# EasyEDA schematic easyeda-schematic.json
TITLE: Sheet_1; REV: 1.0; Date: 2021-05-10; Sheet: 1/1; Drawn By: till.klocke; Company: Your Company
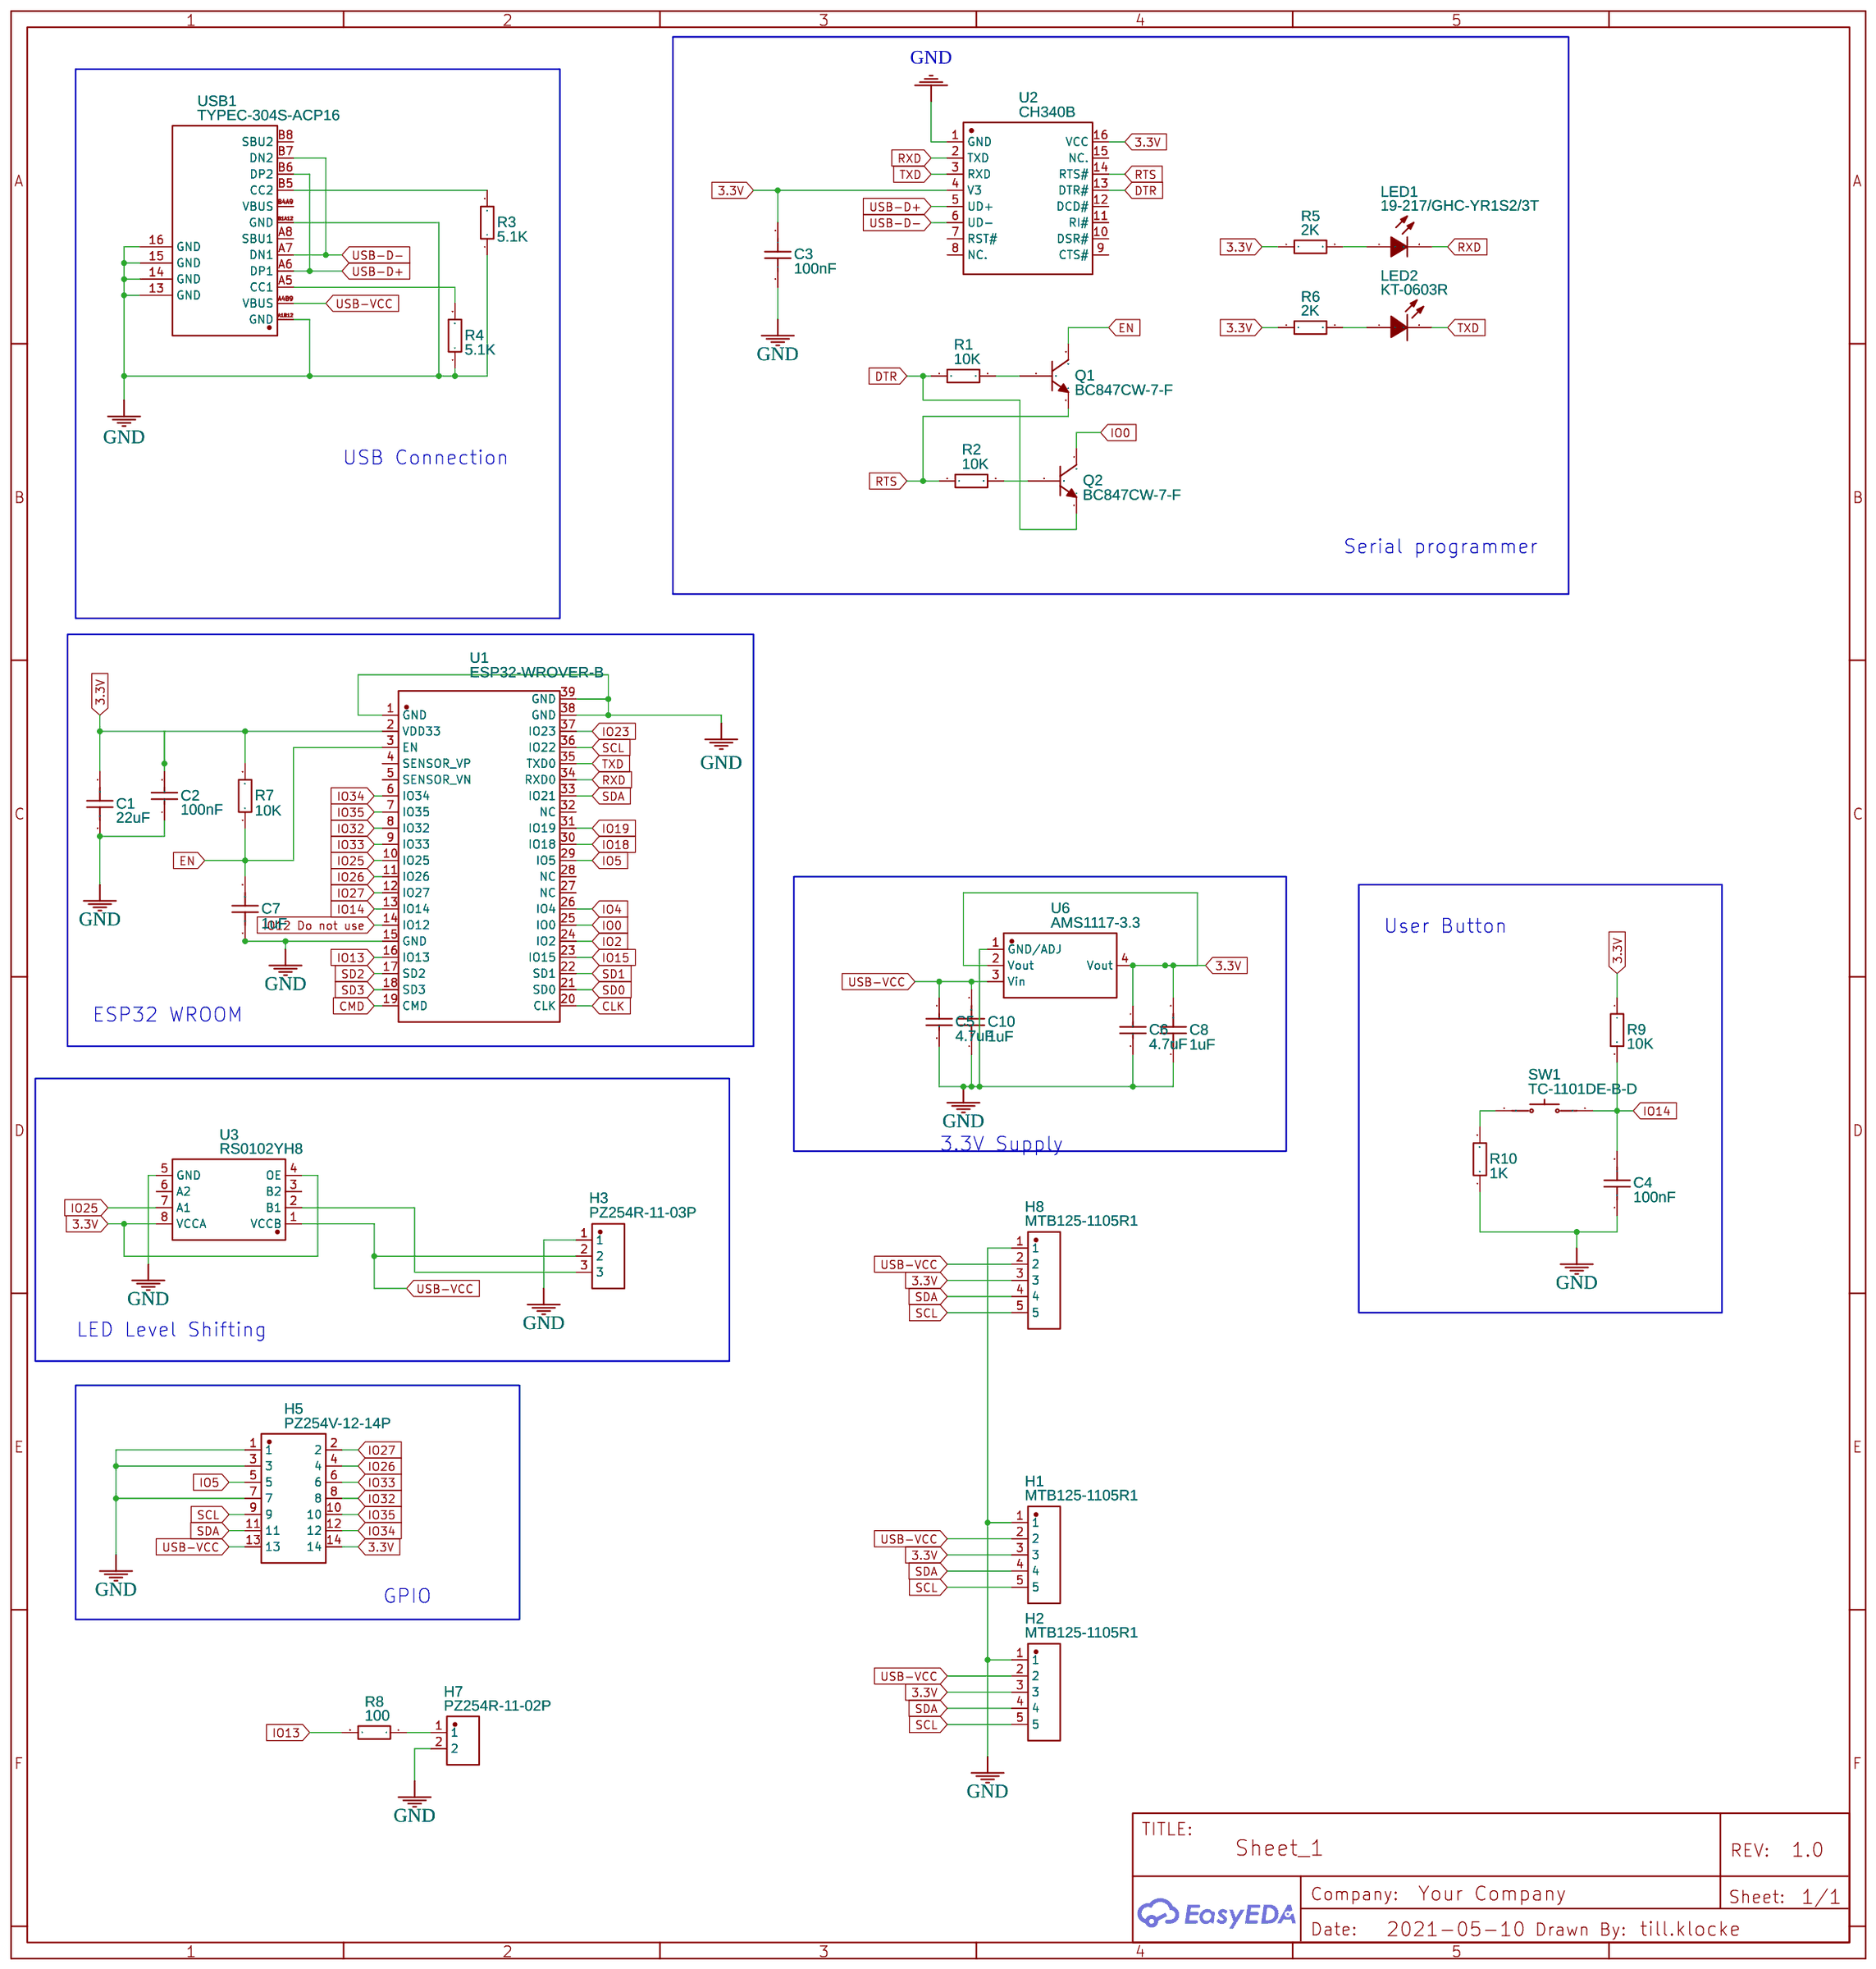
[diagram p0: schematic sheet]

## Parts
C1  22uF  [C0603]
C2  100nF  [C0402]
C3  100nF  [C0603]
C4  100nF  [C0603]
C5  4.7uF  [C0402]
C6  4.7uF  [C0402]
C7  1uF  [C0402]
C8  1uF  [C0402]
C10  1uF  [C0402]
H1  MTB125-1105R1  [HDR-TH_5P-P2.54-H-M-W10.0]
H2  MTB125-1105R1  [HDR-TH_5P-P2.54-H-M-W10.0]
H3  PZ254R-11-03P  [HDR-TH_3P-P2.54-H-M-W10.4]
H5  PZ254V-12-14P  [HDR-TH_14P-P2.54-V-M-R2-C7-S2.54]
H7  PZ254R-11-02P  [HDR-TH_2P-P2.54-H-M-W10.4]
H8  MTB125-1105R1  [HDR-TH_5P-P2.54-H-M-W10.0]
LED1  19-217/GHC-YR1S2/3T  [LED0603-R-RD]
LED2  KT-0603R  [LED0603-R-RD]
Q1  BC847CW-7-F  [SC-70-3_L2.1-W1.3-P1.30-LS2.1-BR]
Q2  BC847CW-7-F  [SC-70-3_L2.1-W1.3-P1.30-LS2.1-BR]
R1  10K  [R0402]
R2  10K  [R0402]
R3  5.1K  [R0805]
R4  5.1K  [R0805]
R5  2K  [R0402]
R6  2K  [R0402]
R7  10K  [R0402]
R8  100  [R0402]
R9  10K  [R0402]
R10  1K  [R0402]
SW1  TC-1101DE-B-D  [SW-TH_L6.1-W5.0-P5.00]
U1  ESP32-WROVER-B  [WIFIM-SMD_39P-L31.4-W18.0-P1.27]
U2  CH340B  [SOIC-16_L9.9-W3.9-P1.27-LS6.0-BL]
U3  RS0102YH8  [SOT-23-8_L3.0-W1.7-P0.65-LS2.8-BL]
U6  AMS1117-3.3  [SOT-223-3_L6.5-W3.4-P2.30-LS7.0-BR]
USB1  TYPEC-304S-ACP16  [USB-C-SMD_TYPEC-304S-ACP16]

## Library data of the parts
C1 = CL10A226MQ8NRNC: Supplier: LCSC; Manufacturer: SAMSUNG; Supplier Part: C59461; SMT Type: Basic; JLCPCB SMD: Yes; LCSC Assembly: Yes; Paste Type: base
C2 = CL05B104KO5NNNC: Supplier: LCSC; Manufacturer: SAMSUNG; Supplier Part: C1525; SMT Type: Basic; JLCPCB SMD: Yes; LCSC Assembly: Yes; Paste Type: base
C3 C4 = CC0603KRX7R9BB104: Supplier: LCSC; Manufacturer: YAGEO; Supplier Part: C14663; SMT Type: Basic; JLCPCB SMD: Yes; LCSC Assembly: Yes; Paste Type: base
C5 C6 = CL05A475MP5NRNC: Supplier: LCSC; Manufacturer: SAMSUNG; Supplier Part: C23733; SMT Type: Basic; JLCPCB SMD: Yes; LCSC Assembly: Yes; Paste Type: base
C7 C8 C10 = CL05A105KA5NQNC: Supplier: LCSC; Manufacturer: SAMSUNG; Supplier Part: C52923; SMT Type: Basic; JLCPCB SMD: Yes; LCSC Assembly: Yes; Paste Type: base
H1 H2 H8 = MTB125-1105R1: Supplier: LCSC; Supplier Part: C376123; Manufacturer: MINTRON; Contributor: LCSC; JLCPCB Part Class: Extended Part
H3 = PZ254R-11-03P: Supplier: LCSC; Supplier Part: C492411; Manufacturer: XFCN; Contributor: LCSC; JLCPCB Part Class: Extended Part
H5 = PZ254V-12-14P: Supplier: LCSC; Supplier Part: C492424; Manufacturer: XFCN; Contributor: LCSC; JLCPCB Part Class: Extended Part
H7 = PZ254R-11-02P: Supplier: LCSC; Supplier Part: C492410; Manufacturer: XFCN; Contributor: LCSC; JLCPCB Part Class: Extended Part
LED1 = 19-217/GHC-YR1S2/3T: Supplier: LCSC; Manufacturer: EVERLIGHT; image: //image.lceda.cn/szlcsc/C72043.jpg; Supplier Part: C72043; SMT Type: Basic; JLCPCB SMD: Yes; LCSC Assembly: Yes; Paste Type: base
LED2 = KT-0603R: Supplier: LCSC; Manufacturer: KENTO; image: //image.lceda.cn/szlcsc/C2286.jpg; Supplier Part: C2286; SMT Type: Basic; JLCPCB SMD: Yes; LCSC Assembly: Yes; Paste Type: base
Q1 Q2 = BC847CW-7-F: Supplier: LCSC; Manufacturer: DIODES; Contributor: LCSC; Supplier Part: C151600; SMT Type: Extend; JLCPCB SMD: Yes; LCSC Assembly: Yes; Paste Type: expand
R1 R2 R7 R9 = 0402WGF1002TCE: Supplier: LCSC; Manufacturer: UniOhm; Supplier Part: C25744; SMT Type: Basic; JLCPCB SMD: Yes; LCSC Assembly: Yes; Paste Type: base
R3 R4 = 0805W8F5101T5E: Supplier: LCSC; Manufacturer: UniOhm; Supplier Part: C27834; SMT Type: Basic; JLCPCB SMD: Yes; LCSC Assembly: Yes; Paste Type: base
R5 R6 = 0402WGJ0202TCE: Supplier: LCSC; Manufacturer: UniOhm; Supplier Part: C25552; SMT Type: Extend; JLCPCB SMD: Yes; LCSC Assembly: Yes; Paste Type: expand
R8 = RC0402FR-07100RL: Supplier: LCSC; Manufacturer: YAGEO; Supplier Part: C106232; JLCPCB Part Class: Extended Part
R10 = 0402WGF1001TCE: Supplier: LCSC; Manufacturer: UniOhm; Supplier Part: C11702; JLCPCB Part Class: Basic Part
SW1 = TC-1101DE-B-D: Supplier: LCSC; Supplier Part: C561494; Manufacturer: XKB Enterprise; Contributor: LCSC; JLCPCB Part Class: Extended Part
U1 = ESP32-WROVER-B: Supplier: LCSC; Supplier Part: C503591; Manufacturer: Espressif Systems; Contributor: LCSC; JLCPCB Part Class: Extended Part
U2 = CH340B: Supplier: LCSC; Manufacturer: WCH; image: //image.lceda.cn/szlcsc/C81010.jpg; Supplier Part: C81010; LCSC Assembly: Yes; SMT Type: Extend; Paste Type: expand
U3 = RS0102YH8: Supplier: LCSC; Supplier Part: C783414; Manufacturer: Jiangsu RUNIC Tech; Contributor: LCSC; JLCPCB Part Class: Extended Part
U6 = AMS1117-3.3: sourceId: dwIGgezVh; Supplier: LCSC; Manufacturer: AMS; image: //image.lceda.cn/szlcsc/C6186.jpg; Supplier Part: C6186; SMT Type: Basic; JLCPCB SMD: Yes; LCSC Assembly: Yes; Paste Type: base
USB1 = TYPEC-304S-ACP16: Supplier: LCSC; Supplier Part: C720630; Manufacturer: XUNPU; Contributor: LCSC; Paste Type: expand

## Nets
3.3V: C1.1 C2.2 C3.2 C6.1 C8.2 H1.3 H2.3 H5.14 H8.3 R5.1 R6.1 R7.2 R9.1 U1.2(VDD33) U2.4(V3) U2.16(VCC) U3.4(OE) U3.8(VCCA) U6.2(Vout) U6.4(Vout)
GND: C1.2 C2.1 C3.1 C4.1 C5.2 C6.2 C7.1 C8.1 C10.1 H1.1 H2.1 H3.1 H5.1 H5.3 H5.7 H7.2 H8.1 R3.1 R4.1 R10.1 U1.1(GND) U1.15(GND) U1.38(GND) U1.39(GND) U2.1(GND) U3.5(GND) U6.1(GND/ADJ) USB1.13(GND) USB1.14(GND) USB1.15(GND) USB1.16(GND) USB1.A1B12(GND) USB1.B1A12(GND)
CLK: U1.20(CLK)
CMD: U1.19(CMD)
DTR: Q2.2(E) R1.1 U2.13(DTR#)
EN: C7.2 Q1.3(C) R7.1 U1.3(EN)
IO0: Q2.3(C) U1.25(IO0)
IO2: U1.24(IO2)
IO4: U1.26(IO4)
IO5: H5.5 U1.29(IO5)
IO12 Do not use: U1.14(IO12)
IO13: R8.2 U1.16(IO13)
IO14: C4.2 R9.2 SW1.2 U1.13(IO14)
IO15: U1.23(IO15)
IO18: U1.30(IO18)
IO19: U1.31(IO19)
IO23: U1.37(IO23)
IO25: U1.10(IO25) U3.7(A1)
IO26: H5.4 U1.11(IO26)
IO27: H5.2 U1.12(IO27)
IO32: H5.8 U1.8(IO32)
IO33: H5.6 U1.9(IO33)
IO34: H5.12 U1.6(IO34)
IO35: H5.10 U1.7(IO35)
RTS: Q1.2(E) R2.1 U2.14(RTS#)
RXD: LED1.2(C) U1.34(RXD0) U2.2(TXD)
SCL: H1.5 H2.5 H5.9 H8.5 U1.36(IO22)
SD0: U1.21(SD0)
SD1: U1.22(SD1)
SD2: U1.17(SD2)
SD3: U1.18(SD3)
SDA: H1.4 H2.4 H5.11 H8.4 U1.33(IO21)
TXD: LED2.2(K) U1.35(TXD0) U2.3(RXD)
USB-D+: U2.5(UD+) USB1.A6(DP1) USB1.B6(DP2)
USB-D-: U2.6(UD-) USB1.A7(DN1) USB1.B7(DN2)
USB-VCC: C5.1 C10.2 H1.2 H2.2 H3.2 H5.13 H8.2 U3.1(VCCB) U6.3(Vin) USB1.A4B9(VBUS)
Net-(H3-3): H3.3 U3.2(B1)
Net-(H7-1): H7.1 R8.1
Net-(LED1-1): LED1.1(A) R5.2
Net-(LED2-1): LED2.1(A) R6.2
Net-(Q1-1): Q1.1(B) R1.2
Net-(Q2-1): Q2.1(B) R2.2
Net-(R3-2): R3.2 USB1.B5(CC2)
Net-(R4-2): R4.2 USB1.A5(CC1)
Net-(R10-2): R10.2 SW1.1

Not connected (* = marked no-connect by the designer): U1 4(SENSOR_VP) 5(SENSOR_VN) 27(NC) 28(NC) 32(NC); U2 7(RST#) 8(NC.) 9(CTS#) 10(DSR#) 11(RI#) 12(DCD#) 15(NC.); U3 3(B2) 6(A2); USB1 A8(SBU1) B4A9(VBUS) B8(SBU2)

## Notes on the sheet
- USB Connection
- Serial programmer
- User Button
- ESP32 WROOM
- 3.3V Supply
- LED Level Shifting
- GPIO
